# Altium schematic sheet EHR.SchDoc
size 566 x 322 mm
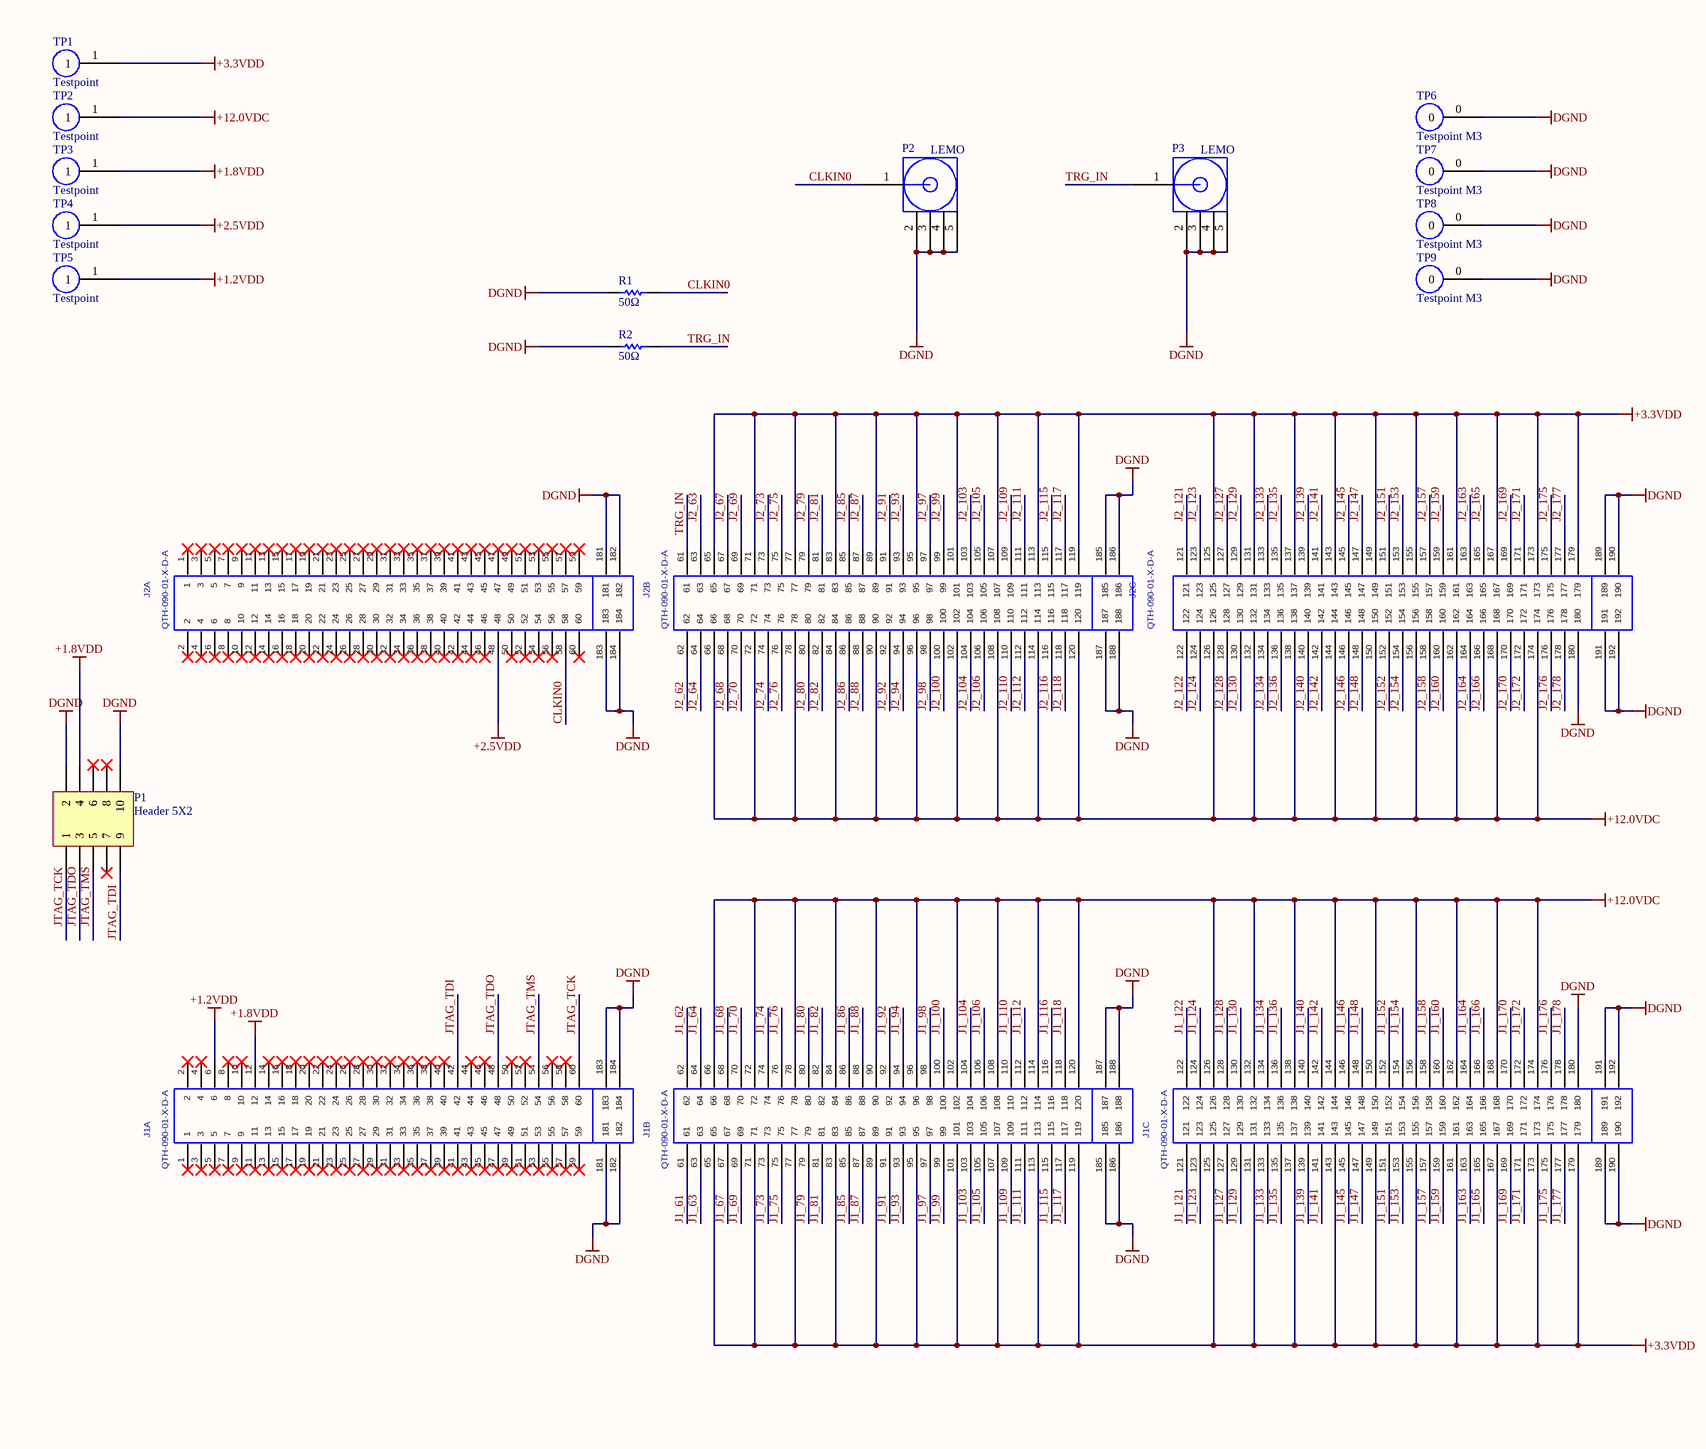
[diagram p0: EHR.SchDoc, left]
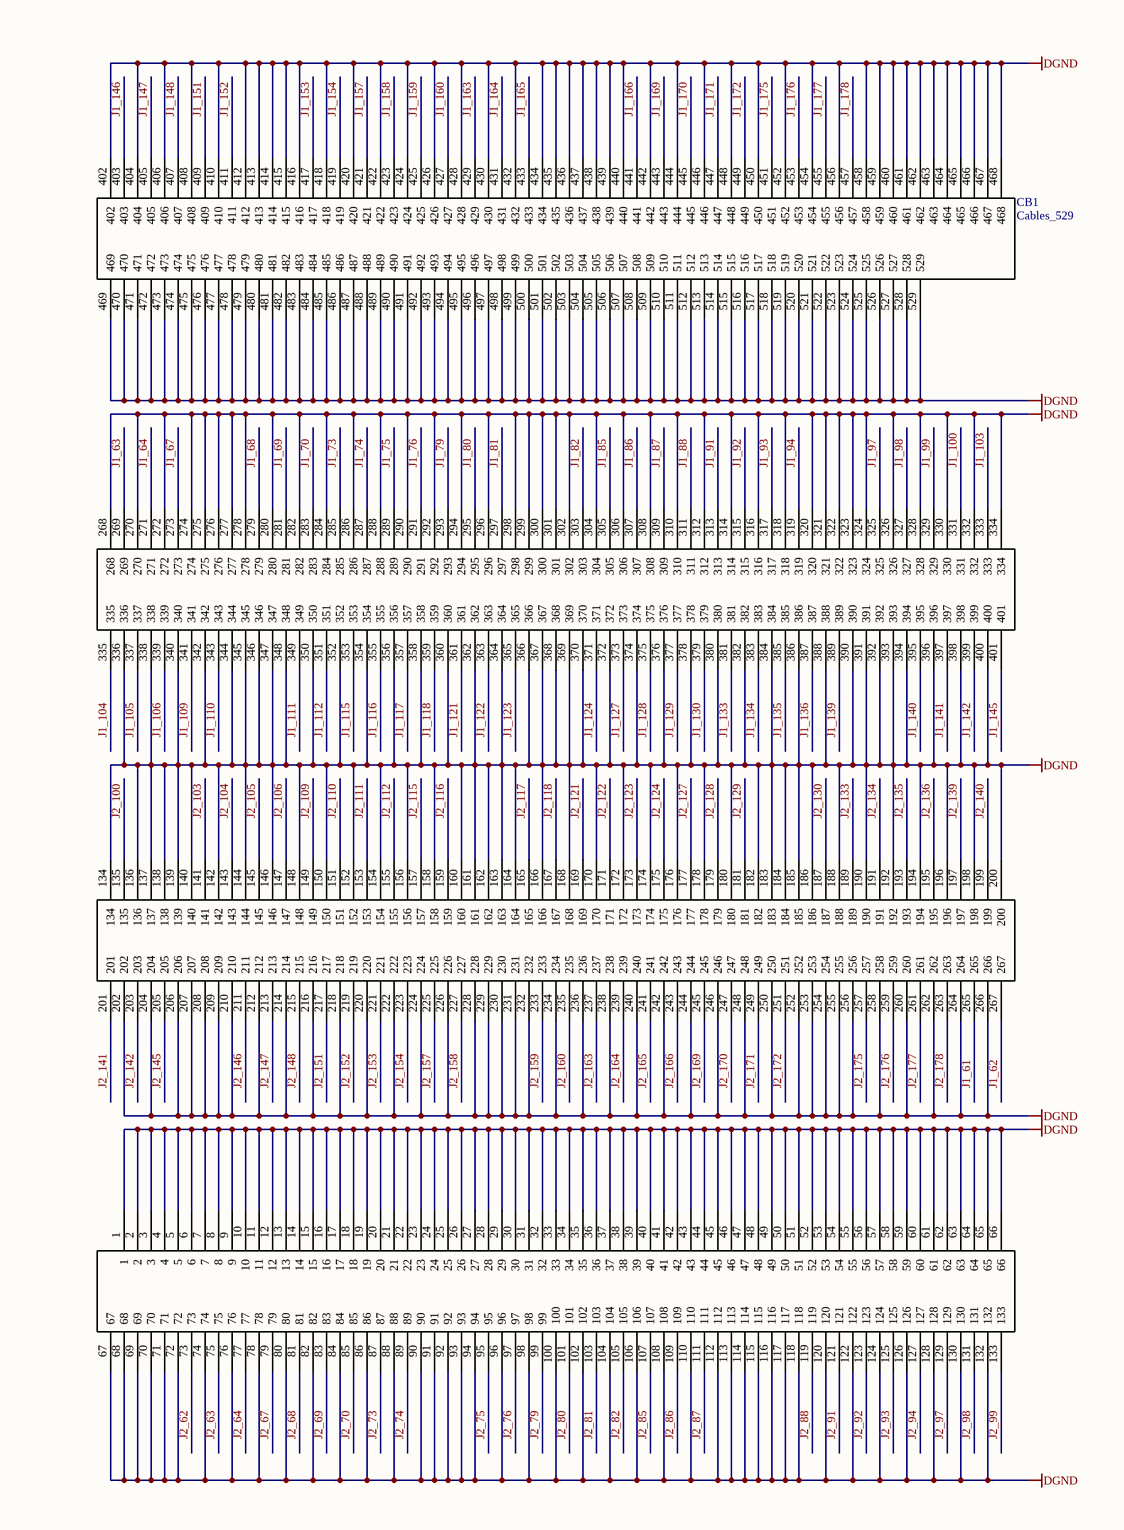
[diagram p1: EHR.SchDoc, right]

## Parts
CB1  Cables_529  [EHR23x23_M3]
J1  QTH-090-01-X-D-A  [QTH-090-01-X-D-A]  (parts A,B,C of 3)
J2  QTH-090-01-X-D-A  [QTH-090-01-X-D-A]  (parts A,B,C of 3)
P1  Header 5X2  [HDR2X5]
P2  LEMO  [LEMO_F]
P3  LEMO  [LEMO_F]
R1  50Ω  [AXIAL-0.3]
R2  50Ω  [AXIAL-0.3]
TP1  Testpoint  [Pad_mid]
TP2  Testpoint  [Pad_mid]
TP3  Testpoint  [Pad_mid]
TP4  Testpoint  [Pad_mid]
TP5  Testpoint  [Pad_mid]
TP6  Testpoint M3  [Testpoint_M3]
TP7  Testpoint M3  [Testpoint_M3]
TP8  Testpoint M3  [Testpoint_M3]
TP9  Testpoint M3  [Testpoint_M3]

## Nets
+1.2VDD: J1.6 TP5.1
+1.8VDD: J1.12 P1.4 TP3.1
+2.5VDD: J2.48 TP4.1
+3.3VDD: J1.65 J1.71 J1.77 J1.83 J1.89 J1.95 J1.101 J1.107 J1.113 J1.119 J1.125 J1.131 J1.137 J1.143 J1.149 J1.155 J1.161 J1.167 J1.173 J1.179 J2.65 J2.71 J2.77 J2.83 J2.89 J2.95 J2.101 J2.107 J2.113 J2.119 J2.125 J2.131 J2.137 J2.143 J2.149 J2.155 J2.161 J2.167 J2.173 J2.179 TP1.1
+12.0VDC: J1.66 J1.72 J1.78 J1.84 J1.90 J1.96 J1.102 J1.108 J1.114 J1.120 J1.126 J1.132 J1.138 J1.144 J1.150 J1.156 J1.162 J1.168 J1.174 J2.66 J2.72 J2.78 J2.84 J2.90 J2.96 J2.102 J2.108 J2.114 J2.120 J2.126 J2.132 J2.138 J2.144 J2.150 J2.156 J2.162 J2.168 J2.174 TP2.1
DGND: CB1.1 CB1.2 CB1.3 CB1.4 CB1.5 CB1.6 CB1.7 CB1.8 CB1.9 CB1.10 CB1.11 CB1.12 CB1.13 CB1.14 CB1.15 CB1.16 CB1.17 CB1.18 CB1.19 CB1.20 CB1.21 CB1.22 CB1.23 CB1.24 CB1.25 CB1.26 CB1.27 CB1.28 CB1.29 CB1.30 CB1.31 CB1.32 CB1.33 CB1.34 CB1.35 CB1.36 CB1.37 CB1.38 CB1.39 CB1.40 CB1.41 CB1.42 CB1.43 CB1.44 CB1.45 CB1.46 CB1.47 CB1.48 CB1.49 CB1.50 CB1.51 CB1.52 CB1.53 CB1.54 CB1.55 CB1.56 CB1.57 CB1.58 CB1.59 CB1.60 CB1.61 CB1.62 CB1.63 CB1.64 CB1.65 CB1.66 CB1.67 CB1.68 CB1.69 CB1.70 CB1.71 CB1.72 CB1.74 CB1.76 CB1.78 CB1.80 CB1.82 CB1.84 CB1.86 CB1.88 CB1.90 CB1.91 CB1.92 CB1.93 CB1.94 CB1.96 CB1.98 CB1.100 CB1.102 CB1.104 CB1.106 CB1.108 CB1.110 CB1.112 CB1.113 CB1.114 CB1.115 CB1.116 CB1.117 CB1.118 CB1.120 CB1.122 CB1.124 CB1.126 CB1.128 CB1.130 CB1.132 CB1.134 CB1.136 CB1.137 CB1.138 CB1.139 CB1.140 CB1.142 CB1.144 CB1.146 CB1.148 CB1.150 CB1.152 CB1.154 CB1.156 CB1.158 CB1.160 CB1.161 CB1.162 CB1.163 CB1.164 CB1.166 CB1.168 CB1.170 CB1.172 CB1.174 CB1.176 CB1.178 CB1.180 CB1.182 CB1.183 CB1.184 CB1.185 CB1.186 CB1.188 CB1.190 CB1.192 CB1.194 CB1.196 CB1.198 CB1.200 CB1.202 CB1.204 CB1.206 CB1.207 CB1.208 CB1.209 CB1.210 CB1.212 CB1.214 CB1.216 CB1.218 CB1.220 CB1.222 CB1.224 CB1.226 CB1.228 CB1.229 CB1.230 CB1.231 CB1.232 CB1.234 CB1.236 CB1.238 CB1.240 CB1.242 CB1.244 CB1.246 CB1.248 CB1.250 CB1.252 CB1.253 CB1.254 CB1.255 CB1.256 CB1.258 CB1.260 CB1.262 CB1.264 CB1.266 CB1.268 CB1.270 CB1.272 CB1.274 CB1.275 CB1.276 CB1.277 CB1.278 CB1.280 CB1.282 CB1.284 CB1.286 CB1.288 CB1.290 CB1.292 CB1.294 CB1.296 CB1.298 CB1.299 CB1.300 CB1.301 CB1.302 CB1.304 CB1.306 CB1.308 CB1.310 CB1.312 CB1.314 CB1.316 CB1.318 CB1.320 CB1.321 CB1.322 CB1.323 CB1.324 CB1.326 CB1.328 CB1.330 CB1.332 CB1.334 CB1.336 CB1.338 CB1.340 CB1.342 CB1.344 CB1.345 CB1.346 CB1.347 CB1.348 CB1.350 CB1.352 CB1.354 CB1.356 CB1.358 CB1.360 CB1.362 CB1.364 CB1.366 CB1.367 CB1.368 CB1.369 CB1.370 CB1.372 CB1.374 CB1.376 CB1.378 CB1.380 CB1.382 CB1.384 CB1.386 CB1.388 CB1.390 CB1.391 CB1.392 CB1.393 CB1.394 CB1.396 CB1.398 CB1.400 CB1.402 CB1.404 CB1.406 CB1.408 CB1.410 CB1.412 CB1.413 CB1.414 CB1.415 CB1.416 CB1.418 CB1.420 CB1.422 CB1.424 CB1.426 CB1.428 CB1.430 CB1.432 CB1.434 CB1.435 CB1.436 CB1.437 CB1.438 CB1.439 CB1.440 CB1.442 CB1.444 CB1.446 CB1.448 CB1.450 CB1.452 CB1.454 CB1.456 CB1.458 CB1.459 CB1.460 CB1.461 CB1.462 CB1.463 CB1.464 CB1.465 CB1.466 CB1.467 CB1.468 CB1.469 CB1.470 CB1.471 CB1.472 CB1.473 CB1.474 CB1.475 CB1.476 CB1.477 CB1.478 CB1.479 CB1.480 CB1.481 CB1.482 CB1.483 CB1.484 CB1.485 CB1.486 CB1.487 CB1.488 CB1.489 CB1.490 CB1.491 CB1.492 CB1.493 CB1.494 CB1.495 CB1.496 CB1.497 CB1.498 CB1.499 CB1.500 CB1.501 CB1.502 CB1.503 CB1.504 CB1.505 CB1.506 CB1.507 CB1.508 CB1.509 CB1.510 CB1.511 CB1.512 CB1.513 CB1.514 CB1.515 CB1.516 CB1.517 CB1.518 CB1.519 CB1.520 CB1.521 CB1.522 CB1.523 CB1.524 CB1.525 CB1.526 CB1.527 CB1.528 CB1.529 J1.180 J1.181 J1.182 J1.183 J1.184 J1.185 J1.186 J1.187 J1.188 J1.189 J1.190 J1.191 J1.192 J2.180 J2.181 J2.182 J2.183 J2.184 J2.185 J2.186 J2.187 J2.188 J2.189 J2.190 J2.191 J2.192 P1.2 P1.10 P2.2 P2.3 P2.4 P2.5 P3.2 P3.3 P3.4 P3.5 R1.1 R2.1 TP6.0 TP7.0 TP8.0 TP9.0
CLKIN0: J2.58 P2.1 R1.2
J1_61: CB1.265 J1.61
J1_62: CB1.267 J1.62
J1_63: CB1.269 J1.63
J1_64: CB1.271 J1.64
J1_67: CB1.273 J1.67
J1_68: CB1.279 J1.68
J1_69: CB1.281 J1.69
J1_70: CB1.283 J1.70
J1_73: CB1.285 J1.73
J1_74: CB1.287 J1.74
J1_75: CB1.289 J1.75
J1_76: CB1.291 J1.76
J1_79: CB1.293 J1.79
J1_80: CB1.295 J1.80
J1_81: CB1.297 J1.81
J1_82: CB1.303 J1.82
J1_85: CB1.305 J1.85
J1_86: CB1.307 J1.86
J1_87: CB1.309 J1.87
J1_88: CB1.311 J1.88
J1_91: CB1.313 J1.91
J1_92: CB1.315 J1.92
J1_93: CB1.317 J1.93
J1_94: CB1.319 J1.94
J1_97: CB1.325 J1.97
J1_98: CB1.327 J1.98
J1_99: CB1.329 J1.99
J1_100: CB1.331 J1.100
J1_103: CB1.333 J1.103
J1_104: CB1.335 J1.104
J1_105: CB1.337 J1.105
J1_106: CB1.339 J1.106
J1_109: CB1.341 J1.109
J1_110: CB1.343 J1.110
J1_111: CB1.349 J1.111
J1_112: CB1.351 J1.112
J1_115: CB1.353 J1.115
J1_116: CB1.355 J1.116
J1_117: CB1.357 J1.117
J1_118: CB1.359 J1.118
J1_121: CB1.361 J1.121
J1_122: CB1.363 J1.122
J1_123: CB1.365 J1.123
J1_124: CB1.371 J1.124
J1_127: CB1.373 J1.127
J1_128: CB1.375 J1.128
J1_129: CB1.377 J1.129
J1_130: CB1.379 J1.130
J1_133: CB1.381 J1.133
J1_134: CB1.383 J1.134
J1_135: CB1.385 J1.135
J1_136: CB1.387 J1.136
J1_139: CB1.389 J1.139
J1_140: CB1.395 J1.140
J1_141: CB1.397 J1.141
J1_142: CB1.399 J1.142
J1_145: CB1.401 J1.145
J1_146: CB1.403 J1.146
J1_147: CB1.405 J1.147
J1_148: CB1.407 J1.148
J1_151: CB1.409 J1.151
J1_152: CB1.411 J1.152
J1_153: CB1.417 J1.153
J1_154: CB1.419 J1.154
J1_157: CB1.421 J1.157
J1_158: CB1.423 J1.158
J1_159: CB1.425 J1.159
J1_160: CB1.427 J1.160
J1_163: CB1.429 J1.163
J1_164: CB1.431 J1.164
J1_165: CB1.433 J1.165
J1_166: CB1.441 J1.166
J1_169: CB1.443 J1.169
J1_170: CB1.445 J1.170
J1_171: CB1.447 J1.171
J1_172: CB1.449 J1.172
J1_175: CB1.451 J1.175
J1_176: CB1.453 J1.176
J1_177: CB1.455 J1.177
J1_178: CB1.457 J1.178
J2_62: CB1.73 J2.62
J2_63: CB1.75 J2.63
J2_64: CB1.77 J2.64
J2_67: CB1.79 J2.67
J2_68: CB1.81 J2.68
J2_69: CB1.83 J2.69
J2_70: CB1.85 J2.70
J2_73: CB1.87 J2.73
J2_74: CB1.89 J2.74
J2_75: CB1.95 J2.75
J2_76: CB1.97 J2.76
J2_79: CB1.99 J2.79
J2_80: CB1.101 J2.80
J2_81: CB1.103 J2.81
J2_82: CB1.105 J2.82
J2_85: CB1.107 J2.85
J2_86: CB1.109 J2.86
J2_87: CB1.111 J2.87
J2_88: CB1.119 J2.88
J2_91: CB1.121 J2.91
J2_92: CB1.123 J2.92
J2_93: CB1.125 J2.93
J2_94: CB1.127 J2.94
J2_97: CB1.129 J2.97
J2_98: CB1.131 J2.98
J2_99: CB1.133 J2.99
J2_100: CB1.135 J2.100
J2_103: CB1.141 J2.103
J2_104: CB1.143 J2.104
J2_105: CB1.145 J2.105
J2_106: CB1.147 J2.106
J2_109: CB1.149 J2.109
J2_110: CB1.151 J2.110
J2_111: CB1.153 J2.111
J2_112: CB1.155 J2.112
J2_115: CB1.157 J2.115
J2_116: CB1.159 J2.116
J2_117: CB1.165 J2.117
J2_118: CB1.167 J2.118
J2_121: CB1.169 J2.121
J2_122: CB1.171 J2.122
J2_123: CB1.173 J2.123
J2_124: CB1.175 J2.124
J2_127: CB1.177 J2.127
J2_128: CB1.179 J2.128
J2_129: CB1.181 J2.129
J2_130: CB1.187 J2.130
J2_133: CB1.189 J2.133
J2_134: CB1.191 J2.134
J2_135: CB1.193 J2.135
J2_136: CB1.195 J2.136
J2_139: CB1.197 J2.139
J2_140: CB1.199 J2.140
J2_141: CB1.201 J2.141
J2_142: CB1.203 J2.142
J2_145: CB1.205 J2.145
J2_146: CB1.211 J2.146
J2_147: CB1.213 J2.147
J2_148: CB1.215 J2.148
J2_151: CB1.217 J2.151
J2_152: CB1.219 J2.152
J2_153: CB1.221 J2.153
J2_154: CB1.223 J2.154
J2_157: CB1.225 J2.157
J2_158: CB1.227 J2.158
J2_159: CB1.233 J2.159
J2_160: CB1.235 J2.160
J2_163: CB1.237 J2.163
J2_164: CB1.239 J2.164
J2_165: CB1.241 J2.165
J2_166: CB1.243 J2.166
J2_169: CB1.245 J2.169
J2_170: CB1.247 J2.170
J2_171: CB1.249 J2.171
J2_172: CB1.251 J2.172
J2_175: CB1.257 J2.175
J2_176: CB1.259 J2.176
J2_177: CB1.261 J2.177
J2_178: CB1.263 J2.178
JTAG_TCK: J1.60 P1.1
JTAG_TDI: J1.42 P1.9
JTAG_TDO: J1.48 P1.3
JTAG_TMS: J1.54 P1.5
TRG_IN: J2.61 P3.1 R2.2

Not connected (* = marked no-connect by the designer): J1 1* 2* 3* 4* 5* 7* 8* 9* 10* 11* 13* 14* 15* 16* 17* 18* 19* 20* 21* 22* 23* 24* 25* 26* 27* 28* 29* 30* 31* 32* 33* 34* 35* 36* 37* 38* 39* 40* 41* 43* 44* 45* 46* 47* 49* 50* 51* 52* 53* 55* 56* 57* 58* 59*; J2 1* 2* 3* 4* 5* 6* 7* 8* 9* 10* 11* 12* 13* 14* 15* 16* 17* 18* 19* 20* 21* 22* 23* 24* 25* 26* 27* 28* 29* 30* 31* 32* 33* 34* 35* 36* 37* 38* 39* 40* 41* 42* 43* 44* 45* 46* 47* 49* 50* 51* 52* 53* 54* 55* 56* 57* 59* 60*; P1 6* 7* 8*

## Library data of the parts
J1 J2 = QTH-090-01-X-D-A: HIGH SPEED TERMINAL STRIP, .5mm PITCH, 180 PINS.; MANUFACTURER: SAMTEC; CREATED: July 30, 2014 - WENDY XIN; PCB DECAL: QTH-090-01-X-D-A
P1 = Header 5X2: Header, 5-Pin, Dual row; LatestRevisionDate: 17-Jul-2002; LatestRevisionNote: Re-released for DXP Platform.; Publisher: Altium Limited
R1 R2 = Res1: Resistor; Value: 1K; Published: 8-Jun-2000; LatestRevisionDate: 17-Jul-2002; LatestRevisionNote: Re-released for DXP Platform.; PackageReference: AXIAL-0.3; Publisher: Altium Limited; PackageDescription: Axial Device, Thru-Hole; 2 Leads; 0.3 in Pin Spacing
TP1-TP5 = Pad_med: Testpoint middle
TP6-TP9 = Pad_M3